# Altium schematic sheet BOC_VGA_KB_MOUSE.SchDoc: Board-On-Chip VGA, KB, and Mouse
size A; Organization: Altium Limited; Address1: L3, 12a Rodborough Rd; Address2: Frenchs Forest; Address3: NSW; Address4: Australia 2086; Revision: 1.06; SheetNumber: 15; SheetTotal: 16
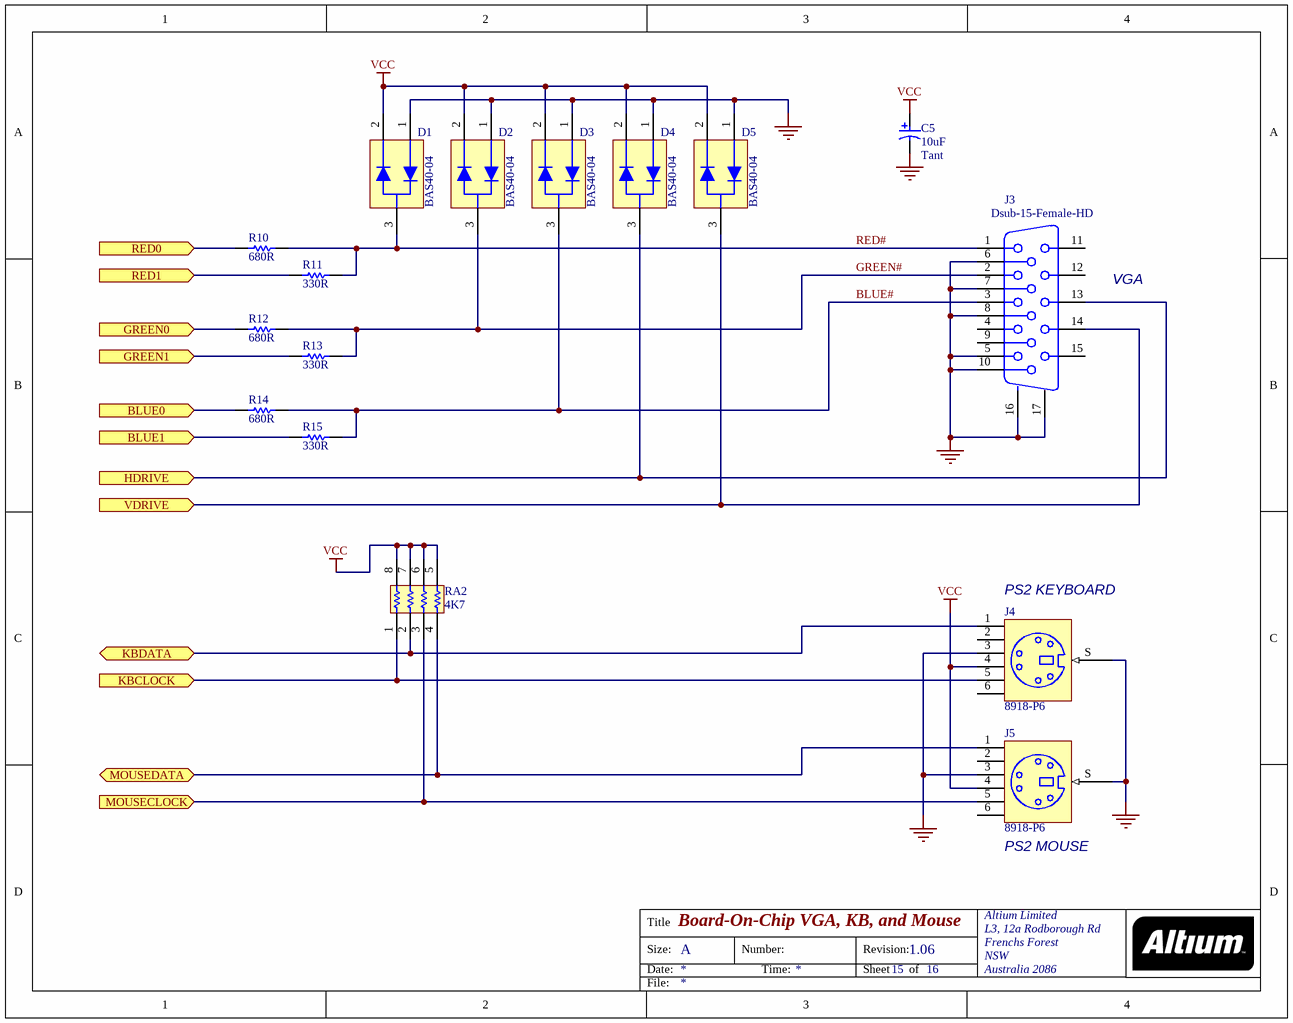
[diagram p0: BOC_VGA_KB_MOUSE.SchDoc]

## Parts
C5  10uF  Capacitor Type: Tant  [MCCT-B]
D1  BAS40-04  [SO-G3]
D2  BAS40-04  [SO-G3]
D3  BAS40-04  [SO-G3]
D4  BAS40-04  [SO-G3]
D5  BAS40-04  [SO-G3]
J3  Dsub-15-Female-HD  [DB15-VGA-Female]
J4  8918-P6  [PS2-6PIN]
J5  8918-P6  [PS2-6PIN]
R10  680R  [CC2012-0805]
R11  330R  [CC2012-0805]
R12  680R  [CC2012-0805]
R13  330R  [CC2012-0805]
R14  680R  [CC2012-0805]
R15  330R  [CC2012-0805]
RA2  4K7  [MNR34]

## Ports
BLUE0 (in), BLUE1 (in), GREEN0 (in), GREEN1 (in), HDRIVE (in), KBCLOCK (in), KBDATA (bidir), MOUSECLOCK (in), MOUSEDATA (bidir), RED0 (in), RED1 (in), VDRIVE (in)

## Nets
GND: C5.2 D1.1 D2.1 D3.1 D4.1 D5.1 J3.5 J3.6 J3.7 J3.8 J3.10 J3.16(MH1) J3.17(MH2) J4.3 J4.S J5.3 J5.S
VCC: C5.1 D1.2 D2.2 D3.2 D4.2 D5.2 J4.4 J5.4 RA2.5 RA2.6 RA2.7 RA2.8
BLUE0: R14.1 ; port BLUE0
BLUE1: R15.1 ; port BLUE1
BLUE#: D3.3 J3.3 R14.2 R15.2
GREEN0: R12.1 ; port GREEN0
GREEN1: R13.1 ; port GREEN1
GREEN#: D2.3 J3.2 R12.2 R13.2
HDRIVE: D4.3 J3.13 ; port HDRIVE
KBCLOCK: J4.5 RA2.1 ; port KBCLOCK
KBDATA: J4.1 RA2.2 ; port KBDATA
MOUSECLOCK: J5.5 RA2.3 ; port MOUSECLOCK
MOUSEDATA: J5.1 RA2.4 ; port MOUSEDATA
RED0: R10.1 ; port RED0
RED1: R11.1 ; port RED1
RED#: D1.3 J3.1 R10.2 R11.2
VDRIVE: D5.3 J3.14 ; port VDRIVE

Not connected (* = marked no-connect by the designer): J3 4 9 11 12 15; J4 2 6; J5 2 6

## Notes on the sheet
- VGA
- (near J4) PS2 KEYBOARD
- (near J5) PS2 MOUSE
- Title
- Size:
- Date:
- A
- Number:
- Time:
- Revision:
- Sheet
- of
- File:

## Library data of the parts
C5 = CAP_POLAR: Polar Capacitor; Fitted: True; Supplier: FARNELL; Supplier Code: 967-117
D1-D5 = BAS40-04: Shottky Diode Pair; Fitted: True
J3 = Dsub-15-Female-HD: Dsub-15 High density VGA Female connetor; Manufacturer: Generic Components; Package Information: Latest Revision: E; Class I: Connector; Positions: 30; Gender: Receptacle Header; Fitted: True; Published: 15-Jun-2001; Revision: July-2002: Re-released for DXP Platform.; Datasheet: (31-Oct-1991); Package Reference: 174213; Publisher: Altium Limited; Orientation: Right Angle
J4 J5 = PS2-6PIN: 6 Pin Through Hole PS2 Socket (Kycon P/N); Fitted: True; Webpdf: http://www.kycon.com/Pub_Eng_Draw/KFMDG-xS-BSC.pdf
R10-R15 = RES: Resistor; Fitted: True
RA2 = MNR34: 3216x4 Resistor Array; Fitted: True